# EAGLE design phton_neopixel (EAGLE 7.4.0)
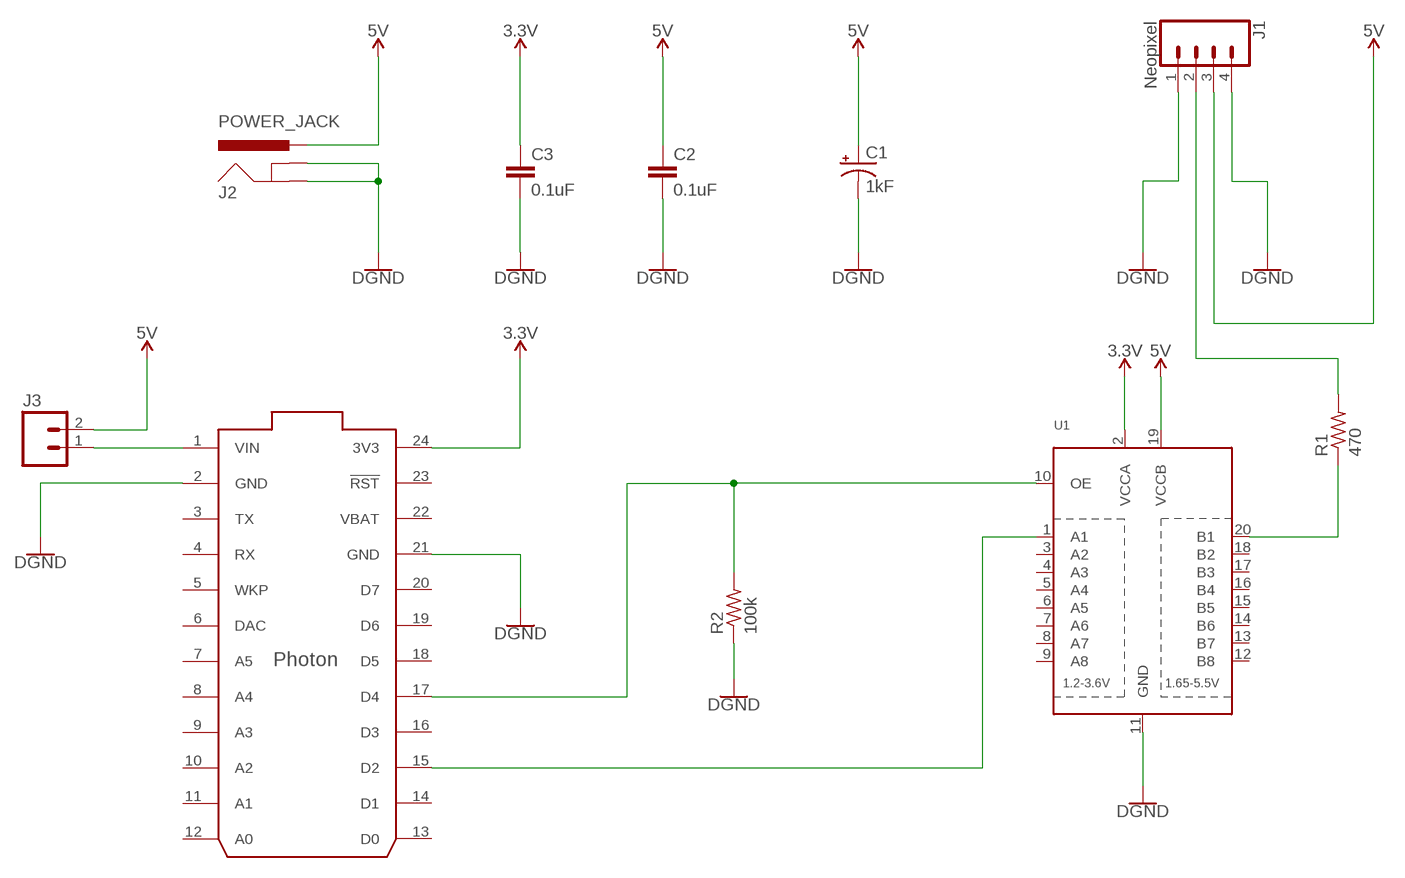
[diagram p0: schematic, sheet 1]

## Parts
C1  1kF  1000UF-RADIAL-5MM-25V-20%  [CPOL-RADIAL-5MM-10MM]
C2  0.1uF  0.1UF-25V-5%(0603)  [0603-CAP]
C3  0.1uF  0.1UF-25V-5%(0603)  [0603-CAP]
J1  Neopixel  CONN_04  [1X04]
J2  POWER_JACK  [POWER_JACK_PTH]
J3  M02PTH  [1X02]
R1  470  R-US_0207/7  [0207/7]
R2  100k  R-US_0207/7  [0207/7]
U1  TXB0108PWR  [TSSOP20]
U2  PHOTON_WITH_HEADERS  [PHOTON]

## Nets
3.3V: C3.1 U1.2(VCCA) U2.24(3V3)
5V: C1.+ C2.1 J1.3 J2.PWR J3.2 U1.19(VCCB)
GND: C1.- C2.2 C3.2 J1.1 J1.4 J2.GND J2.GNDBREAK R2.1 U1.11(GND) U2.2(GND) U2.21(GND) ; supply symbol labelled DGND
N$1: R1.1 U1.20(B1)
N$2: J3.1 U2.1(VIN)
N$3: R2.2 U1.10(OE) U2.17(D4)
N$4: J1.2 R1.2
N$5: U1.1(A1) U2.15(D2)
Unconnected: U1.3(A2) U1.4(A3) U1.5(A4) U1.6(A5) U1.7(A6) U1.8(A7) U1.9(A8) U1.12(B8) U1.13(B7) U1.14(B6) U1.15(B5) U1.16(B4) U1.17(B3) U1.18(B2) U2.3(TX) U2.4(RX) U2.5(WKP) U2.6(DAC) U2.7(A5) U2.8(A4) U2.9(A3) U2.10(A2) U2.11(A1) U2.12(A0) U2.13(D0) U2.14(D1) U2.16(D3) U2.18(D5) U2.19(D6) U2.20(D7) U2.23(!RST)

## Power pins joined to a net without a drawn wire
VBAT: U2.22(VBAT)

## Library data of the parts
C1 = SparkFun-Capacitors:1000UF: 1,000µF/1mF ceramic capacitors A capacitor is a passive two-terminal electrical component used to store electrical energy temporarily in an electric field. CAP-08070; PROD_ID: CAP-09538; VALUE: 1mF
C2 C3 = SparkFun-Capacitors:0.1UF-25V-5%(0603): CAP-08604; PROD_ID: CAP-08604
J1 = SparkFun-Connectors:CONN_04: Multi connection point. Often used as Generic Header-pin footprint for 0.1 inch spaced/style header connections On any of the 0.1 inch spaced packages, you can populate with these: Break Away Headers - Straight <https://www.sparkfun.com/products/116> (PRT-00116) Break Away Male Headers - Right Angle <https://www.sparkfun.com/products/553> (PRT-00553) Female Headers <https://www.sparkfun.com/products/115> (PRT-00115) Break Away Headers - Machine Pin <https://www.sparkfun.com/products/117> (PRT-00117) Break Away Female Headers - Swiss Machine Pin <https://www.sparkfun.com/products/743> (PRT-00743) For SCREWTERMINALS and SPRING TERMINALS visit here: Screw Terimnals on SparkFun.com <https://www.sparkfun.com/search/results?term=Screw+Terminals> (5mm/3.5mm/2.54mm spacing) This device is also useful as a general connection point to wire up your design to another part of your project. Our various solder wires solder well into these plated through hole pads. Hook-Up Wire - Assortment (Stranded, 22 AWG) <https://www.sparkfun.com/products/11375> (PRT-11375) Hook-Up Wire - Assortment (Solid Core, 22 AWG) <https://www.sparkfun.com/products/11367> (PRT-11367) View the entire wire category on our website here <https://www.sparkfun.com/categories/141> Special notes: Molex polarized connector foot print use with SKU : PRT-08231 with associated crimp pins and housings. 1MM SMD Version SKU: PRT-10208; PROD_ID: CONN-09696
J2 = SparkFun-Connectors:POWER_JACK: Power Jack Connector This is the standard 5.5mm barrel jack for power. The PTH is the most common, proven, reliable, footprint. The Slot footprint only works if the mill layer is transmitted to the PCB fab house so be warned. Here are the connectors we sell at SparkFun: DC Barrel Power Jack/Connector <https://www.sparkfun.com/products/119> (PRT-00119) DC Barrel Power Jack/Connector (SMD) <https://www.sparkfun.com/products/12748> (PRT-12748) DC Barrel Jack Adapter - Breadboard Compatible <https://www.sparkfun.com/products/10811> (PRT-10811) It is used on this SparkFun product (and many, many others): SparkFun RedBoard - Programmed with Arduino <https://www.sparkfun.com/products/12757> (DEV-12757) Also, if you need a mating power supply or connector, please check these out: Wall Adapter Power Supply - 9VDC 650mA <https://www.sparkfun.com/products/298> (TOL-00298) DC Barrel Jack Adapter - Male <https://www.sparkfun.com/products/10287> (PRT-10287); PROD_ID: CONN-08197
J3 = SparkFun-Connectors:M02: Standard 2-pin 0.1" header. Use with - straight break away headers ( PRT-00116) - right angle break away headers (PRT-00553) - swiss pins (PRT-00743) - machine pins (PRT-00117) - female headers (PRT-00115) Molex polarized connector foot print use with: PRT-08233 with associated crimp pins and housings. 2.54_SCREWTERM for use with PRT-10571. 3.5mm Screw Terminal footprints for PRT-08084 5mm Screw Terminal footprints for use with PRT-08432
R1 R2 = resistor:R-US_: RESISTOR, American symbol
U1 = adafruit:TXB0108PWR: 8-Bit Bi-Directional Level Shifter 1.2V-3.6V (VCCA) to 1.65V-5.5V (VCCB) bi-directional level shifter with auto direction sensing. Max data rate - VCCA 1.8V: 20Mbps (50ns), VCCA 3.3V: 100Mbps (10ns) Digikey: 296-21527-1-ND
U2 = Spark:PHOTON

## Board
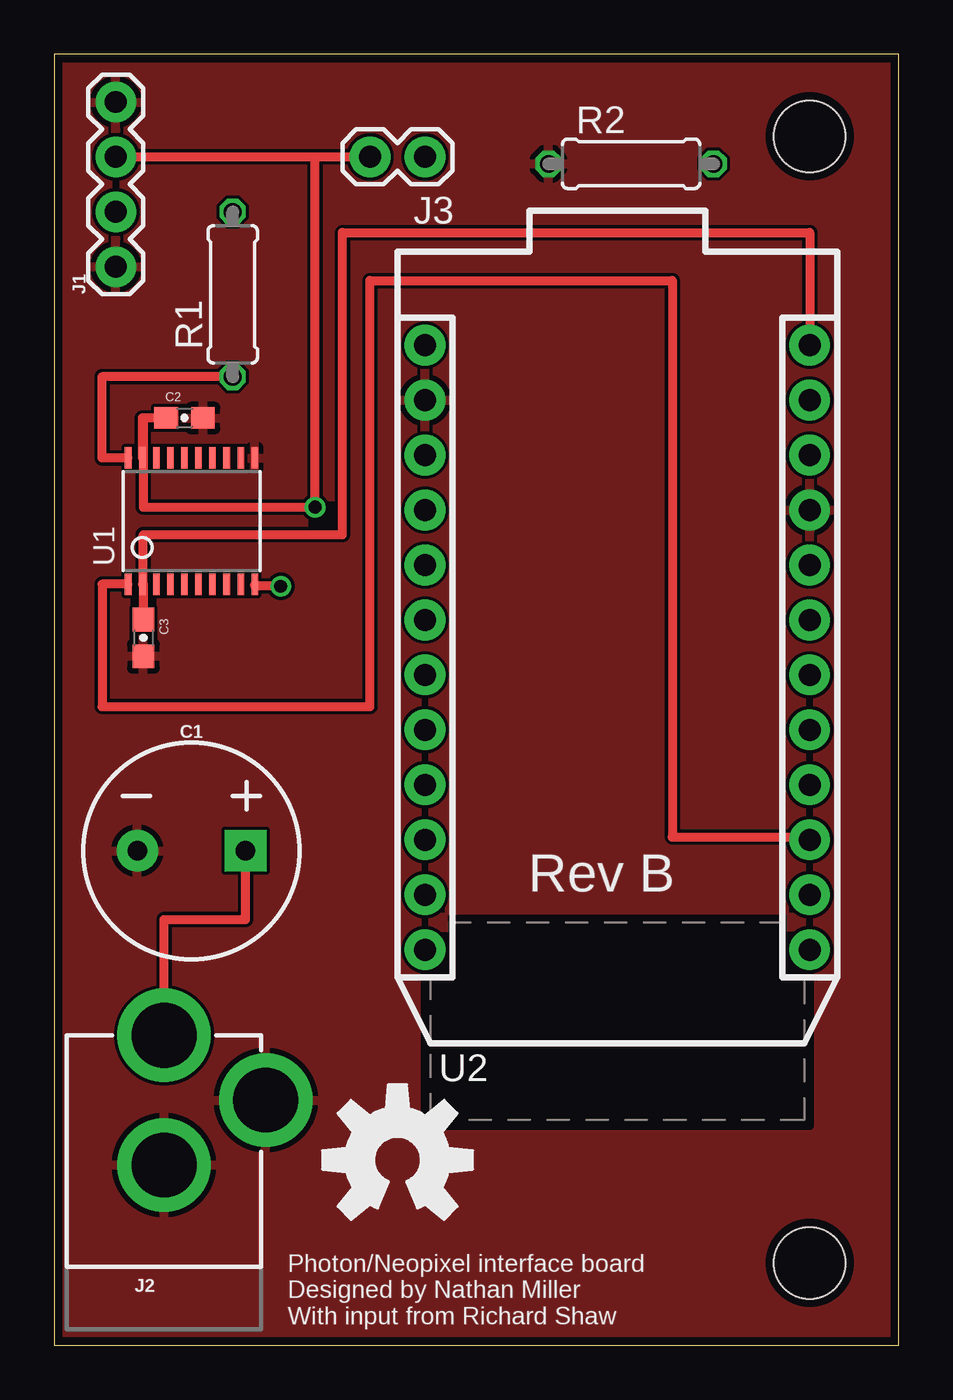
[diagram p1: board, top side]
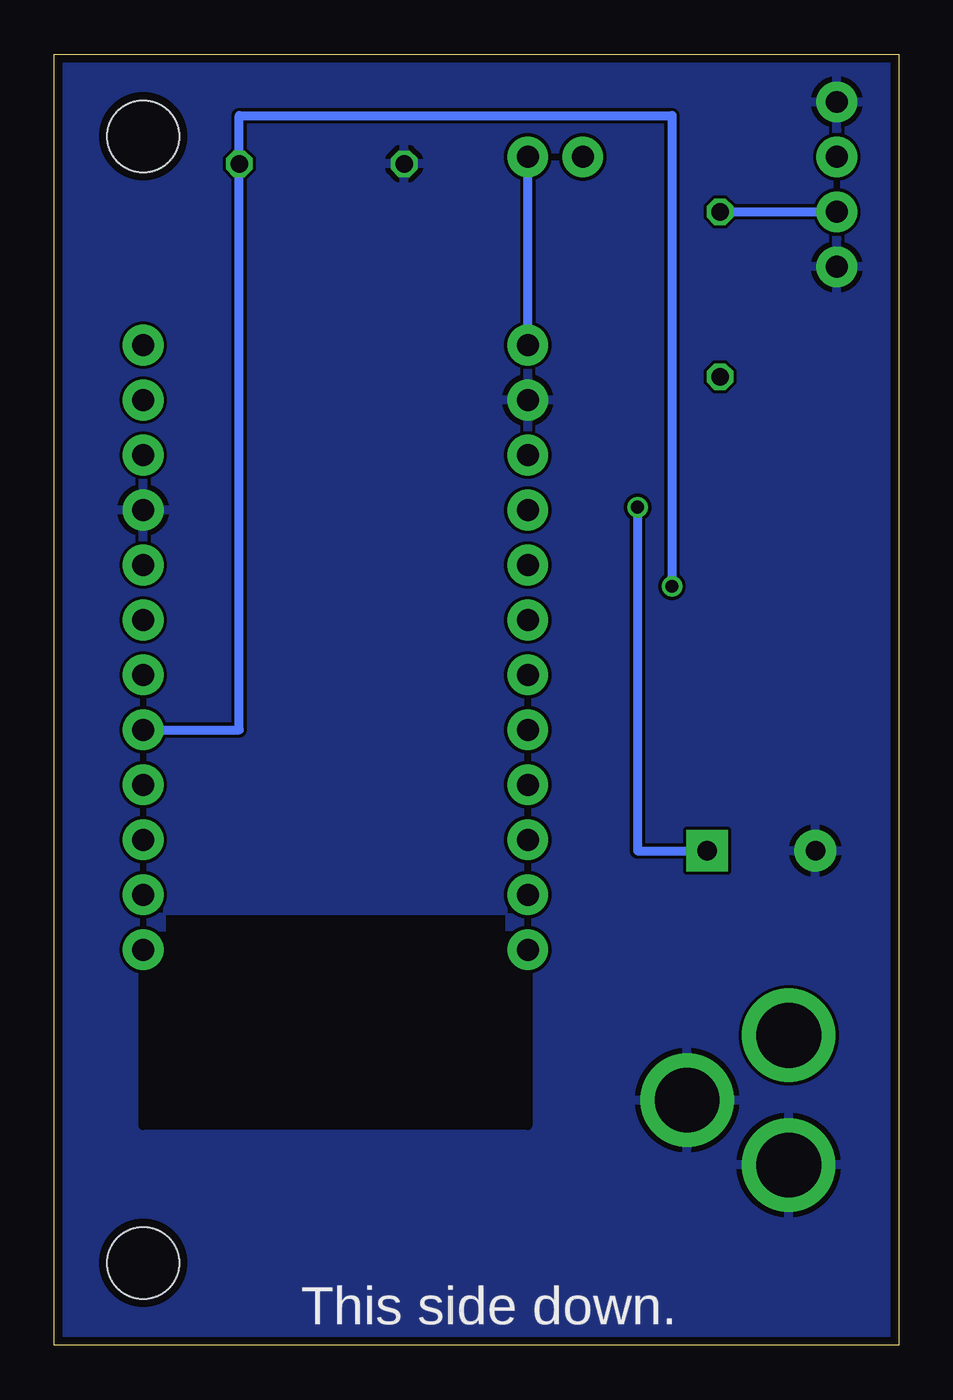
[diagram p2: board, bottom side, seen from below]

Size 39.04 x 59.68 mm. Coordinates in mm from the lower left corner, seen from the top.
Outline: 0,0 39.04,0 39.04,59.68 0,59.68 0,0
Copper layers (1*16): Top 0.0356mm / dielectric 1.5011mm / Bottom 0.0356mm
Design rules "LaenPCBOrder": minimum track width 6mil, minimum drill 13mil, track to track 6mil, track to pad 6mil, pad to pad 6mil, via to via 6mil, smd to smd 6mil, copper to edge 15mil, drill to drill 6mil, minimum pad ring 7mil, minimum via ring 7mil, stop-mask expansion 3mil, vias tented up to drill 0mil, thermal gap 10mil
tRestrict: area 17.1,10.2 to 34.9,19.7
bRestrict: area 17.1,10.2 to 34.9,19.7

### Footprints (pad centres in the part's own frame; a part is rotated, then mirrored left to right if it is on the bottom)
CPOL-RADIAL-5MM-10MM = drill 0.9 pad 1.93 square: + 2.5,0 | drill 0.9 pad 1.93: - -2.5,0
0603-CAP = smd 1.1 x 1: 1 -0.85,0; 2 0.85,0
1X04 = drill 1.016 pad 1.88: 1 0,0; 2 2.54,0; 3 5.08,0; 4 7.62,0
POWER_JACK_PTH = drill 2.997 pad 4.318: GND 0,7.7; GNDBREAK 4.7,10.7; PWR 0,13.7
1X02 = drill 1.016 pad 1.88: 1 0,0; 2 2.54,0
0207/7 = drill 0.813 octagon: 1 -3.81,0; 2 3.81,0
TSSOP20 = smd 0.305 x 0.991: 1 -2.925,-2.918; 2 -2.275,-2.918; 3 -1.625,-2.918; 4 -0.975,-2.918; 5 -0.325,-2.918; 6 0.325,-2.918; 7 0.975,-2.918; 8 1.625,-2.918; 9 2.275,-2.918; 10 2.925,-2.918; 11 2.925,2.918; 12 2.275,2.918; 13 1.625,2.918; 14 0.975,2.918; 15 0.325,2.918; 16 -0.325,2.918; 17 -0.975,2.918; 18 -1.625,2.918; 19 -2.275,2.918; 20 -2.925,2.918
PHOTON = drill 1.016 pad 1.88: 1 1.27,32.258; 2 1.27,29.718; 3 1.27,27.178; 4 1.27,24.638; 5 1.27,22.098; 6 1.27,19.558; 7 1.27,17.018; 8 1.27,14.478; 9 1.27,11.938; 10 1.27,9.398; 11 1.27,6.858; 12 1.27,4.318; 13 19.05,4.318; 14 19.05,6.858; 15 19.05,9.398; 16 19.05,11.938; 17 19.05,14.478; 18 19.05,17.018; 19 19.05,19.558; 20 19.05,22.098; 21 19.05,24.638; 22 19.05,27.178; 23 19.05,29.718; 24 19.05,32.258
STAND-OFF = hole 3.302: 0,0

### Placement (x,y rotation side)
C1  6.35,22.86 0 top
C2  6.03,42.86 0 top
C3  4.13,32.7 270 top
J1  2.86,49.85 90 top
J2  5.08,0.64 0 top
J3  17.14,54.93 180 top
R1  8.26,48.58 90 top
R2  26.67,54.61 0 top
U1  6.35,38.1 0 top
U2  15.88,13.97 0 top
U$1  [OSHW-LOGO-L]  15.88,8.57 0 top
U$2  [STAND-OFF]  34.92,55.88 0 top
U$3  [STAND-OFF]  34.92,3.81 0 top

### Tracks (layer width: path | path; a pad name or v marks a point on that pad's centre or on a via)
3.3V
  Top 0.406: U1.2 4.13,35.18 | 4.13,35.18 C3.1 | 4.13,35.18 4.13,37.47 13.34,37.47 13.34,51.44 34.92,51.44 U2.24
5V  (via drill 0.6)
  Top 0.406: J2.PWR 5.08,19.68 8.85,19.68 C1.+ | C2.1 4.13,42.86 | U1.19 4.08,42.86 4.13,42.86 | J1.3 12.06,54.93 | 12.06,54.93 J3.2 | 4.13,42.86 4.13,38.73 v12.06,38.73 12.06,54.93
  Bottom 0.406: v12.06,38.73 12.06,22.86 C1.+
GND
  pour Bottom: 0,59.69 39.37,59.69 39.37,0 0,0
  pour Top: 0,59.69 39.37,59.69 39.37,0 0,0
N$1
  Top 0.406: R1.1 2.22,44.77 2.22,41.02 U1.20
N$2
  Bottom 0.406: U2.1 J3.1
N$3  (via drill 0.6)
  Top 0.406: v10.48,35.08 9.28,35.08 U1.10
  Bottom 0.406: v10.48,35.08 10.48,56.83 30.48,56.83 R2.2 30.48,28.45 U2.17
N$4
  Bottom 0.406: R1.2 J1.2
N$5
  Top 0.406: U1.1 2.22,35.18 2.22,29.53 14.61,29.53 14.61,49.21 28.57,49.21 28.57,23.5 34.92,23.5 U2.15

### Text on the board
tPlace: Rev B | Photon/Neopixel interface board / Designed by Nathan Miller / With input from Richard Shaw
bPlace: This side down.